# Altium schematic sheet Connector_Sheet.SchDoc
size 420 x 297 mm; SheetNumber: 10; SheetTotal: 10
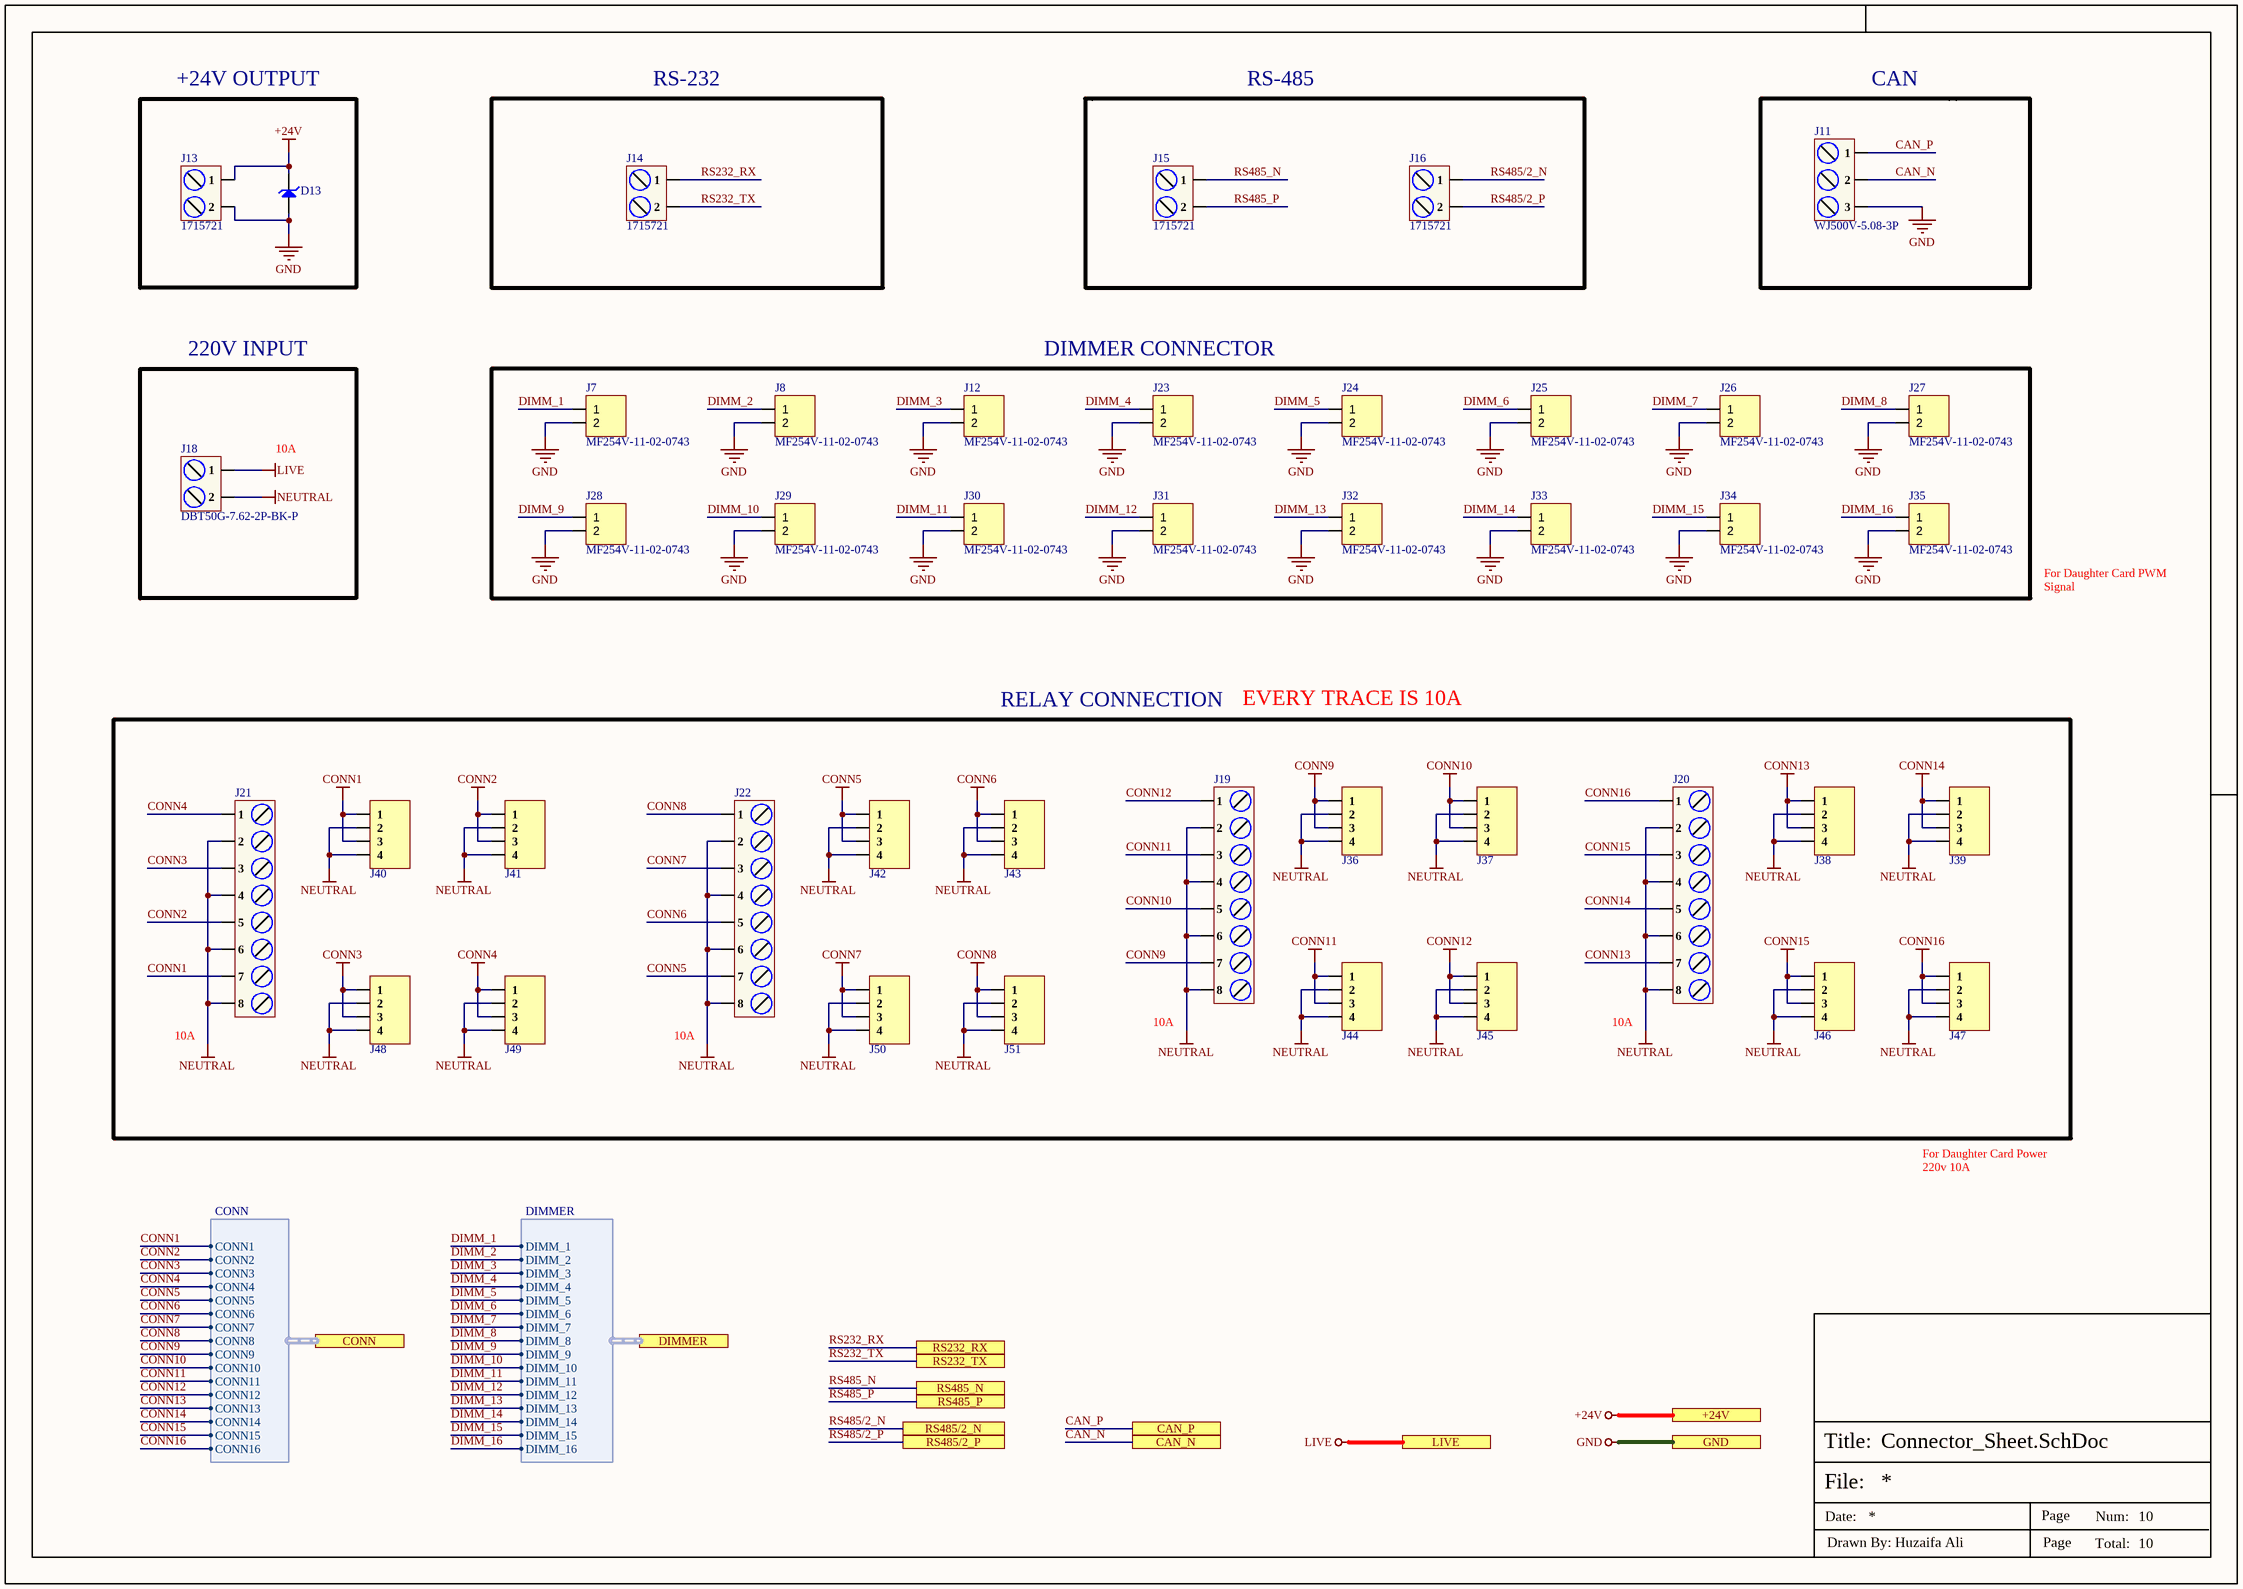
[diagram p0: Connector_Sheet.SchDoc]

## Parts
D13  SMBJ28A-13-F  [SMB_]  (value not drawn)
J7  MF254V-11-02-0743  [MF254V-11-02-0743]
J8  MF254V-11-02-0743  [MF254V-11-02-0743]
J11  WJ500V-5.08-3P  [WJ500V-5.08-3P]
J12  MF254V-11-02-0743  [MF254V-11-02-0743]
J13  1715721  [1715721]
J14  1715721  [1715721]
J15  1715721  [1715721]
J16  1715721  [1715721]
J18  DBT50G-7.62-2P-BK-P  [DBT50G-7.62-2P-BK-P]
J19  DBT50G-7.62-8P-BK-P  [DBT50G-7.62-8P-BK-P]  (value not drawn)
J20  DBT50G-7.62-8P-BK-P  [DBT50G-7.62-8P-BK-P]  (value not drawn)
J21  DBT50G-7.62-8P-BK-P  [DBT50G-7.62-8P-BK-P]  (value not drawn)
J22  DBT50G-7.62-8P-BK-P  [DBT50G-7.62-8P-BK-P]  (value not drawn)
J23  MF254V-11-02-0743  [MF254V-11-02-0743]
J24  MF254V-11-02-0743  [MF254V-11-02-0743]
J25  MF254V-11-02-0743  [MF254V-11-02-0743]
J26  MF254V-11-02-0743  [MF254V-11-02-0743]
J27  MF254V-11-02-0743  [MF254V-11-02-0743]
J28  MF254V-11-02-0743  [MF254V-11-02-0743]
J29  MF254V-11-02-0743  [MF254V-11-02-0743]
J30  MF254V-11-02-0743  [MF254V-11-02-0743]
J31  MF254V-11-02-0743  [MF254V-11-02-0743]
J32  MF254V-11-02-0743  [MF254V-11-02-0743]
J33  MF254V-11-02-0743  [MF254V-11-02-0743]
J34  MF254V-11-02-0743  [MF254V-11-02-0743]
J35  MF254V-11-02-0743  [MF254V-11-02-0743]
J36  0447690401  (value not drawn)
J37  0447690401  (value not drawn)
J38  0447690401  (value not drawn)
J39  0447690401  (value not drawn)
J40  0447690401  (value not drawn)
J41  0447690401  (value not drawn)
J42  0447690401  (value not drawn)
J43  0447690401  (value not drawn)
J44  0447690401  (value not drawn)
J45  0447690401  (value not drawn)
J46  0447690401  (value not drawn)
J47  0447690401  (value not drawn)
J48  0447690401  (value not drawn)
J49  0447690401  (value not drawn)
J50  0447690401  (value not drawn)
J51  0447690401  (value not drawn)

## Blocks framed on the sheet
10A: J18
EVERY TRACE IS 10A: J19-J22 J36-J51

## Ports
+24V (see Top_Sheet[5A], Power_Sheet[5D], Relay_Sheet[5D]), CAN_N (see Top_Sheet[5A], CAN_Sheet[3D]), CAN_P (see Top_Sheet[5A], CAN_Sheet[3D]), CONN (harness CONN, see Top_Sheet[5B], Relay_Sheet[2D]), DIMMER (harness DIMMER, see Top_Sheet[5B], Controller_Sheet[6C]), GND (see Top_Sheet[5A], CAN_Sheet[5D], Controller_Sheet[5D], EtherCAT_Sheet[5D], GPIO_Expander_Sheet[5D], Power_Sheet[5D], Relay_Sheet[5D], RJ45_Sheet[5D], RS485_RS232_Sheet[5D]), LIVE (see Top_Sheet[5B], Relay_Sheet[4D]), RS232_RX (see Top_Sheet[5B], RS485_RS232_Sheet[2D]), RS232_TX (see Top_Sheet[5B], RS485_RS232_Sheet[2D]), RS485/2_N (see Top_Sheet[5B], RS485_RS232_Sheet[1D]), RS485/2_P (see Top_Sheet[5B], RS485_RS232_Sheet[1D]), RS485_N (see Top_Sheet[5B], RS485_RS232_Sheet[1D]), RS485_P (see Top_Sheet[5B], RS485_RS232_Sheet[1D])

## Harnesses
CONN: CONN1, CONN2, CONN3, CONN4, CONN5, CONN6, CONN7, CONN8, CONN9, CONN10, CONN11, CONN12, CONN13, CONN14, CONN15, CONN16
DIMMER: DIMM_1, DIMM_2, DIMM_3, DIMM_4, DIMM_5, DIMM_6, DIMM_7, DIMM_8, DIMM_9, DIMM_10, DIMM_11, DIMM_12, DIMM_13, DIMM_14, DIMM_15, DIMM_16

## Nets
+24V: D13.2(K) J13.1 ; port +24V
CONN1: J21.7 J40.1 J40.3 ; port CONN.CONN1
CONN2: J21.5 J41.1 J41.3 ; port CONN.CONN2
CONN3: J21.3 J48.1 J48.3 ; port CONN.CONN3
CONN4: J21.1 J49.1 J49.3 ; port CONN.CONN4
CONN5: J22.7 J42.1 J42.3 ; port CONN.CONN5
CONN6: J22.5 J43.1 J43.3 ; port CONN.CONN6
CONN7: J22.3 J50.1 J50.3 ; port CONN.CONN7
CONN8: J22.1 J51.1 J51.3 ; port CONN.CONN8
CONN9: J19.7 J36.1 J36.3 ; port CONN.CONN9
CONN10: J19.5 J37.1 J37.3 ; port CONN.CONN10
CONN11: J19.3 J44.1 J44.3 ; port CONN.CONN11
CONN12: J19.1 J45.1 J45.3 ; port CONN.CONN12
CONN13: J20.7 J38.1 J38.3 ; port CONN.CONN13
CONN14: J20.5 J39.1 J39.3 ; port CONN.CONN14
CONN15: J20.3 J46.1 J46.3 ; port CONN.CONN15
CONN16: J20.1 J47.1 J47.3 ; port CONN.CONN16
GND: D13.1(A) J7.2 J8.2 J11.3 J12.2 J13.2 J23.2 J24.2 J25.2 J26.2 J27.2 J28.2 J29.2 J30.2 J31.2 J32.2 J33.2 J34.2 J35.2 ; port GND
LIVE: J18.1 ; port LIVE
NEUTRAL: J18.2 J19.2 J19.4 J19.6 J19.8 J20.2 J20.4 J20.6 J20.8 J21.2 J21.4 J21.6 J21.8 J22.2 J22.4 J22.6 J22.8 J36.2 J36.4 J37.2 J37.4 J38.2 J38.4 J39.2 J39.4 J40.2 J40.4 J41.2 J41.4 J42.2 J42.4 J43.2 J43.4 J44.2 J44.4 J45.2 J45.4 J46.2 J46.4 J47.2 J47.4 J48.2 J48.4 J49.2 J49.4 J50.2 J50.4 J51.2 J51.4
CAN_N: J11.2 ; port CAN_N
CAN_P: J11.1 ; port CAN_P
DIMM_1: J7.1 ; port DIMMER.DIMM_1
DIMM_2: J8.1 ; port DIMMER.DIMM_2
DIMM_3: J12.1 ; port DIMMER.DIMM_3
DIMM_4: J23.1 ; port DIMMER.DIMM_4
DIMM_5: J24.1 ; port DIMMER.DIMM_5
DIMM_6: J25.1 ; port DIMMER.DIMM_6
DIMM_7: J26.1 ; port DIMMER.DIMM_7
DIMM_8: J27.1 ; port DIMMER.DIMM_8
DIMM_9: J28.1 ; port DIMMER.DIMM_9
DIMM_10: J29.1 ; port DIMMER.DIMM_10
DIMM_11: J30.1 ; port DIMMER.DIMM_11
DIMM_12: J31.1 ; port DIMMER.DIMM_12
DIMM_13: J32.1 ; port DIMMER.DIMM_13
DIMM_14: J33.1 ; port DIMMER.DIMM_14
DIMM_15: J34.1 ; port DIMMER.DIMM_15
DIMM_16: J35.1 ; port DIMMER.DIMM_16
RS232_RX: J14.1 ; port RS232_RX
RS232_TX: J14.2 ; port RS232_TX
RS485/2_N: J16.1 ; port RS485/2_N
RS485/2_P: J16.2 ; port RS485/2_P
RS485_N: J15.1 ; port RS485_N
RS485_P: J15.2 ; port RS485_P

## Notes on the sheet
- +24V OUTPUT
- RS-232
- RS-485
- CAN
- 220V INPUT
- (near J23) DIMMER CONNECTOR
- For Daughter Card PWM Signal
- RELAY CONNECTION
- (near J21) 10A
- (near J22) 10A
- (near J19) 10A
- (near J20) 10A
- For Daughter Card Power 220v 10A
- File:
- Title:
- Date:
- Page
- Num:
- Total:
- Drawn By: Huzaifa Ali

## Library data of the parts
D13 = SMBJ28A-13-F: TVS DIODE 28VWM 45.4VC SMB; Manufacturer: Diodes; Test Current: 1mA; Number of Elements: 1; Power Dissipation: 600W; Forward Voltage: 5V; Direction: Unidirectional; Reverse Breakdown Voltage: 31.1V; Max Surge Current: 13.2A; Reverse Standoff Voltage: 28V; Clamping Voltage: 45.4V; Power Line Protection: No; Breakdown Voltage: 35.8V; Max Reverse Leakage Current: 5uA; Value: 330pF; Diode Type: ZENER; Supplier: Future Electronics; Supplier Part Number: 8797342; Manufacturer Part Number: SMBJ28A-13-F; RoHS: Yes; Category: TVS Diodes; Stock: 39000; Pricing: 3000=0.0734, 9000=0.0706, 15000=0.0693, 30000=0.0676, 60000=0.065 (USD); Mounting Technology: Surface Mount; Case/Package: SMB; Pins: 2; Min Operating Temperature: -55°C; Max Operating Temperature: 150°C; Packaging: Tape and Reel; Package Quantity: 3000; Max Power Dissipation: 600W; Series: SMBJ; Number of Unidirectional Channels: 1; Min Breakdown Voltage: 31.1V; Peak Pulse Power: 600W; Polarity: Unidirectional; Termination: SMD/SMT; Peak Pulse Current: 13.2A; Max Breakdown Voltage: 35.8V; Leakage Current: 5uA; Working Voltage: 28V; Voltage Rating (DC): 28V; Max Output current: 13.2A; Clamping Voltage-Max: 45.4V; Length: 4.57mm; Width: 3.9mm; Height: 2.62mm; Radiation Hardening: No; RoHS Compliant: Yes; Lead Free: Lead Free; ComponentLink1URL: https://datasheet.ciiva.com/16387/ds19002-16387564.pdf?src-supplier=Future+Electronics; ComponentLink1Description: https://datasheet.ciiva.com/16387/ds19002-16387564.pdf?src-supplier=Future+Electronics; ComponentLink2URL: https://datasheet.ciiva.com/26912/getdatasheetpartid-234000-26912533.pdf?src-supplier=Verical; ComponentLink2Description: https://datasheet.ciiva.com/26912/getdatasheetpartid-234000-26912533.pdf?src-supplier=Verical; Item Type: Diode
J7 J8 J12 J23-J35 = MF254V-11-02-0743: 2.54mm Single Row 3A 2P -40℃~+105℃ Direct Insert 1x2P Top Round Hole Plugin,P=2.54mm Female Headers ROHS; Manufacturer: XFCN; Item Type: Header; Manufacturer Part Number: MF254V-11-02-0743; LCSC Part Number: C2889984; Package: Plugin,P=2.54mm; ComponentLink1Description: LCSC; ComponentLink1URL: https://www.lcsc.com/product-detail/Female-Headers_XFCN-MF254V-11-02-0743_C2889984.html
J11 = WJ500V-5.08-3P: 1x3P 18A -40℃~+105℃ 250V Green 14~30 Straight pin 5.08mm 2.5 1 3 Plugin,P=5.08mm Screw terminal ROHS; Manufacturer: Ningbo Kangnex Elec; Item Type: Terminal Block; Manufacturer Part Number: WJ500V-5.08-3P; Package: Plugin,P=5.08mm; LCSC Part Number: C72334; ComponentLink1Description: LCSC; ComponentLink1URL: https://www.lcsc.com/product-detail/Screw-terminal_Ningbo-Kangnex-Elec-WJ500V-5-08-3P_C72334.html
J13-J16 = 1715721: TERM BLK 2P SIDE ENT 5.08MM PCB; Manufacturer: Phoenix Contact; Item Type: Terminal Blocks; Supplier: Digikey; Supplier Part Number: 277-1263-ND; Manufacturer Part Number: 1715721; RoHS: Yes; Stock: 13160; Pricing: 1=0.94 (USD); ComponentLink1URL: https://datasheet.ciiva.com/1120/1697161-1120393.pdf?src-supplier=Farnell; ComponentLink1Description: https://datasheet.ciiva.com/1120/1697161-1120393.pdf?src-supplier=Farnell; ComponentLink2URL: https://datasheet.ciiva.com/832/1715721-832095.pdf?src-supplier=Digikey; ComponentLink2Description: https://datasheet.ciiva.com/832/1715721-832095.pdf?src-supplier=Digikey; ComponentLink3URL: https://datasheet.ciiva.com/15169/getdatasheetpartid-212174-15169929.pdf?src-supplier=Verical; ComponentLink3Description: https://datasheet.ciiva.com/15169/getdatasheetpartid-212174-15169929.pdf?src-supplier=Verical; ComponentLink4URL: https://datasheet.ciiva.com/16046/1715721-16046034.pdf?src-supplier=Onlinecomponents.com; ComponentLink4Description: https://datasheet.ciiva.com/16046/1715721-16046034.pdf?src-supplier=Onlinecomponents.com
J18 = DBT50G-7.62-2P-BK-P: 1x2P Corner With Cover Plate 2 1 7.62mm -40℃~+105℃ 20A 300V Black 12~22 Straight Needle Plugin,P=7.62mm Barrier Terminal Blocks ROHS; Manufacturer: DORABO; Manufacturer Part Number: DBT50G-7.62-2P-BK-P; Package: Plugin,P=7.62mm; LCSC Part Number: C496127; Item Type: Terminal Block; ComponentLink1Description: LCSC; ComponentLink1URL: https://www.lcsc.com/product-detail/Barrier-Terminal-Blocks_DORABO-DBT50G-7-62-2P-BK-P_C496127.html
J19-J22 = DBT50G-7.62-8P-BK-P: 1x8P Corner With Cover Plate 8 1 7.62mm -40℃~+105℃ 20A 300V Black 12~22 Straight Needle Plugin,P=7.62mm Barrier Terminal Blocks ROHS; Manufacturer: DORABO; Manufacturer Part Number: DBT50G-7.62-8P-BK-P; Package: Plugin,P=7.62mm; LCSC Part Number: C918112; Item Type: Terminal Block; ComponentLink1Description: LCSC; ComponentLink1URL: https://www.lcsc.com/product-detail/Barrier-Terminal-Blocks_DORABO-DBT50G-7-62-8P-BK-P_C918112.html
J36-J51 = 0447690401: 4 Position Receptacle Connector 0.118" (3.00mm) Through Hole Tin; Manufacturer: Molex; Manufacturer Part Number: 0447690401; Digikey Part Number: 23-0447690401-ND; Item Type: Connector; Package: THT; ComponentLink1Description: Digikey; ComponentLink1URL: https://www.digikey.my/en/products/detail/molex/0447690401/513216?s=N4IgTCBcDaICxwOwDYCcAGO6CMIC6AvkA